# Altium schematic sheet Sheet1.SchDoc (part 1 of 3)
size A4; SheetNumber: 1; SheetTotal: 1
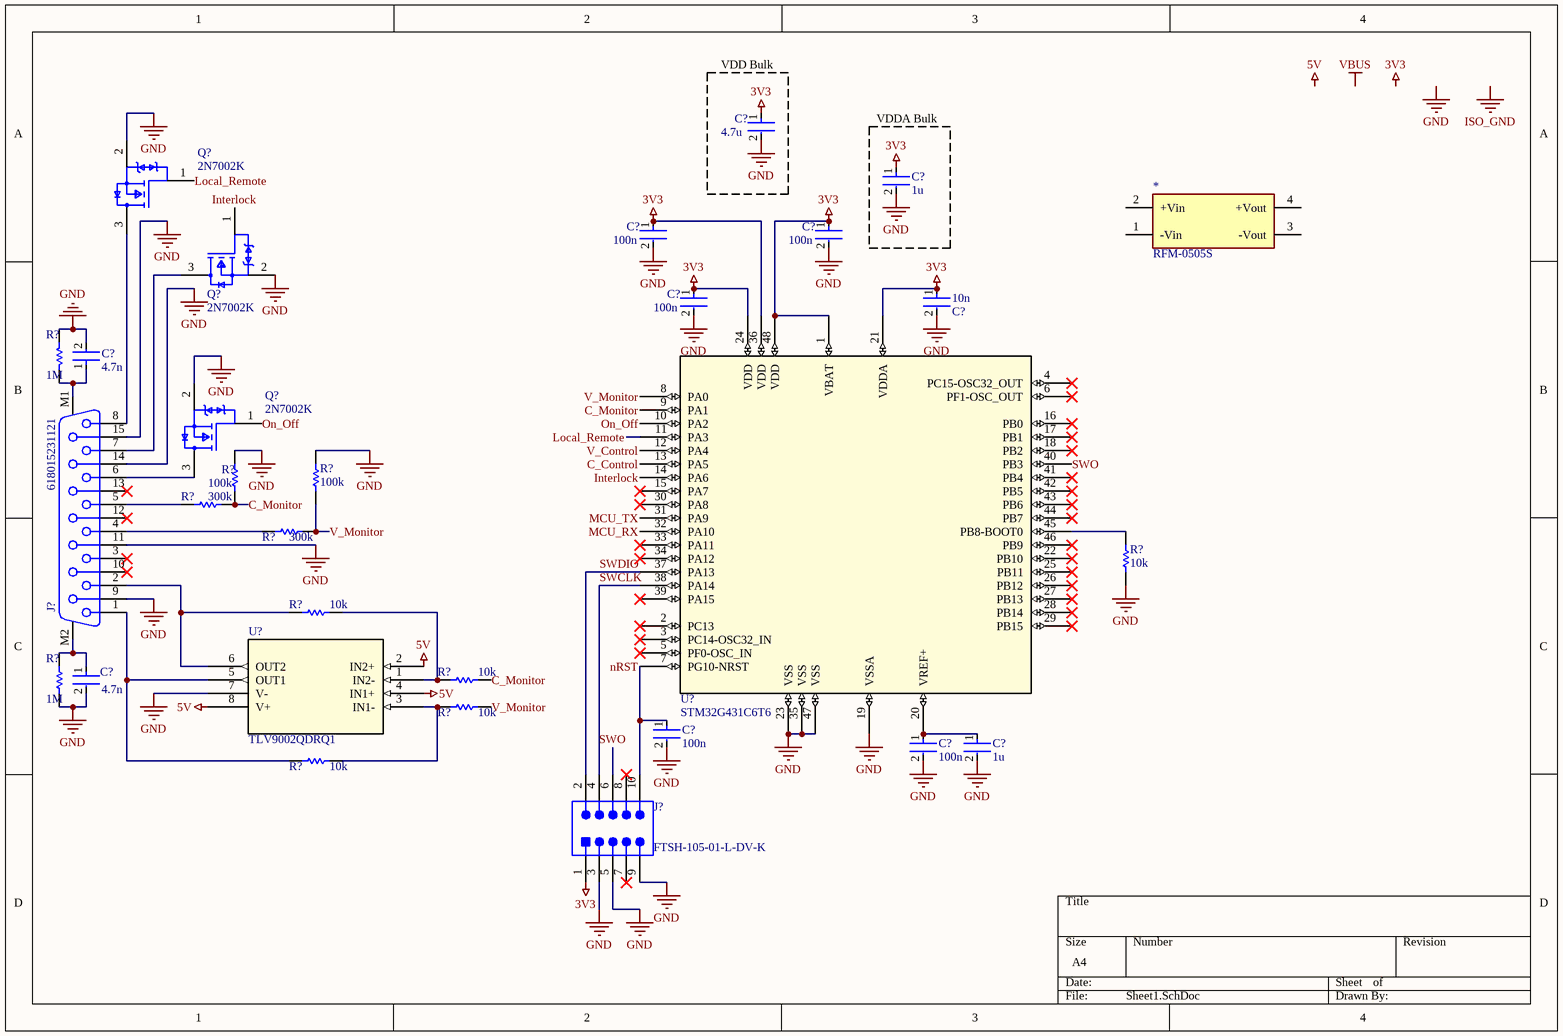
[diagram p0: Sheet1.SchDoc]

## Parts
(Parts that share a designator on the sheet are numbered #1, #2 ... from top to bottom, then left to right.)
10n  C?  [C_IM 0603]
*  RFM-0505S  [4-SIP]
C?#1  4.7u  [C_IM 0805]
C?#2  1u  [C_IM 0603]
C?#3  100n  [C_IM 0603]
C?#4  100n  [C_IM 0603]
C?#5  100n  [C_IM 0603]
C?#6  4.7n  [C_IM 0805]
C?#7  4.7n  [C_IM 0805]
C?#8  100n  [C_IM 0603]
C?#9  100n  [C_IM 0603]
C?#10  1u  [C_IM 0603]
J?#1  618015231121  [618015231121]
J?#2  FTSH-105-01-L-DV-K  [FTSH-105-01-L-DV-K]
Q?#1  2N7002K  [SOT-23-3]
Q?#2  2N7002K  [SOT-23-3]
Q?#3  2N7002K  [SOT-23-3]
R?#1  1M  [R_IM 0805]
R?#2  100k  [R_IM 0805]
R?#3  300k  [R_IM 0805]
R?#4  100k  [R_IM 0805]
R?#5  300k  [R_IM 0805]
R?#6  10k  [R_IM 0805]
R?#7  10k  [R_IM 0805]
R?#8  10k  [R_IM 0805]
R?#9  1M  [R_IM 0805]
R?#10  10k  [R_IM 0805]
R?#11  10k  [R_IM 0805]
U?#1  STM32G431C6T6  [LQFP48-7x7mm]
U?#2  TLV9002QDRQ1  [SOIC8_D_TEX]

## Blocks framed on the sheet
VDD Bulk: C?#1
VDDA Bulk: C?#2

## Nets
3V3: 10n.1 C?#1.1 C?#2.1 C?#3.1 C?#4.1 C?#5.1 J?#2.1 U?#1.1(VBAT) U?#1.21(VDDA) U?#1.24(VDD) U?#1.36(VDD) U?#1.48(VDD)
5V: U?#2.2(IN2+) U?#2.4(IN1+) U?#2.8(V+)
GND: 10n.2 C?#1.2 C?#2.2 C?#3.2 C?#4.2 C?#5.2 C?#6.2 C?#7.2 C?#8.2 C?#9.2 C?#10.2 J?#1.9 J?#1.11 J?#1.14 J?#1.15 J?#2.3 J?#2.5 J?#2.9 Q?#1.2(Source) Q?#2.2(Source) Q?#3.2(Source) R?#1.1 R?#2.1 R?#4.2 R?#6.1 R?#9.1 U?#1.19(VSSA) U?#1.23(VSS) U?#1.35(VSS) U?#1.47(VSS) U?#2.7(V-)
C_Control: U?#1.13(PA5)
C_Monitor: R?#2.2 R?#3.2 R?#8.2 U?#1.9(PA1)
Interlock: Q?#2.1(Gate) U?#1.14(PA6)
Local_Remote: Q?#1.1(Gate) U?#1.11(PA3)
MCU_RX: U?#1.32(PA10)
MCU_TX: U?#1.31(PA9)
nRST: C?#8.1 J?#2.10 U?#1.7(PG10-NRST)
On_Off: Q?#3.1(Gate) U?#1.10(PA2)
SWCLK: J?#2.4 U?#1.38(PA14)
SWDIO: J?#2.2 U?#1.37(PA13)
SWO: J?#2.6 U?#1.40(PB3)
V_Control: U?#1.12(PA4)
V_Monitor: R?#4.1 R?#5.2 R?#10.2 U?#1.8(PA0)
NetC?#6_1: C?#6.1 J?#1.M1 R?#1.2
NetC?#7_1: C?#7.1 J?#1.M2 R?#9.2
NetC?#9_1: C?#9.1 C?#10.1 U?#1.20(VREF+)
NetJ?#1_1: J?#1.1 R?#11.1 U?#2.5(OUT1)
NetJ?#1_2: J?#1.2 R?#7.1 U?#2.6(OUT2)
NetJ?#1_4: J?#1.4 R?#5.1
NetJ?#1_5: J?#1.5 R?#3.1
NetJ?#1_6: J?#1.6 Q?#3.3(Drain)
NetJ?#1_7: J?#1.7 Q?#2.3(Drain)
NetJ?#1_8: J?#1.8 Q?#1.3(Drain)
NetR?#6_2: R?#6.2 U?#1.45(PB8-BOOT0)
NetR?#7_2: R?#7.2 R?#8.1 U?#2.1(IN2-)
NetR?#10_1: R?#10.1 R?#11.2 U?#2.3(IN1-)

Not connected (* = marked no-connect by the designer): * 1(-Vin) 2(+Vin) 3(-Vout) 4(+Vout); J?#1 3* 10* 12* 13*; J?#2 7* 8*; U?#1 2(PC13)* 3(PC14-OSC32_IN)* 4(PC15-OSC32_OUT)* 5(PF0-OSC_IN)* 6(PF1-OSC_OUT)* 15(PA7)* 16(PB0)* 17(PB1)* 18(PB2)* 22(PB10)* 25(PB11)* 26(PB12)* 27(PB13)* 28(PB14)* 29(PB15)* 30(PA8)* 33(PA11)* 34(PA12)* 39(PA15)* 41(PB4)* 42(PB5)* 43(PB6)* 44(PB7)* 46(PB9)*

## Notes on the sheet
- Labels drawn without touching a wire or pin: 3V3, 5V, GND, ISO_GND, VBUS